# Altium schematic sheet NUMATO_HDR.SchDoc
size B
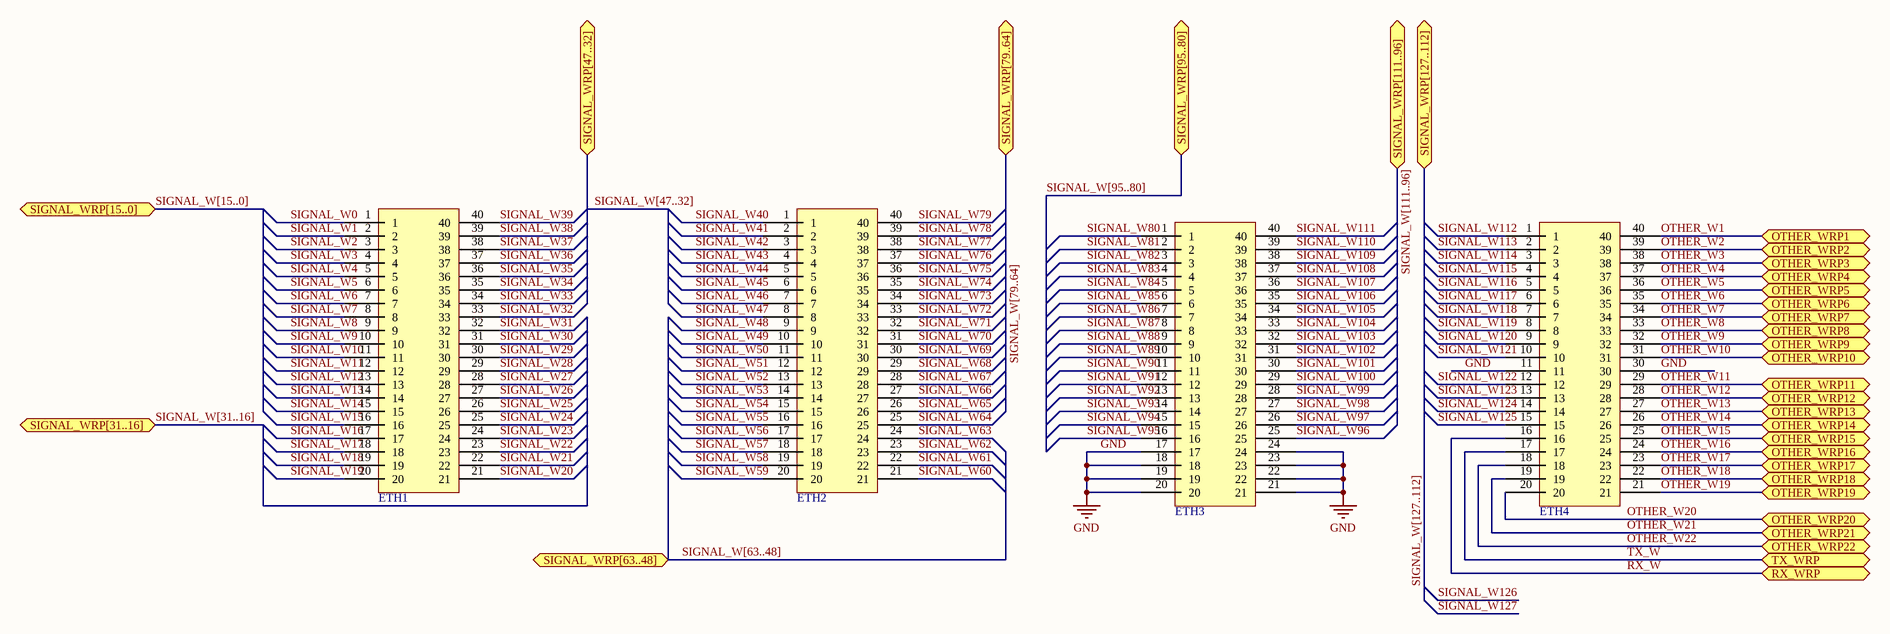
[diagram p0: NUMATO_HDR.SchDoc]

## Parts
ETH1  ADAFRUIT_HEADER  [FEMALE_HEADER_SMD]  (value not drawn)
ETH2  ADAFRUIT_HEADER  [FEMALE_HEADER_SMD]  (value not drawn)
ETH3  ADAFRUIT_HEADER  [FEMALE_HEADER_SMD]  (value not drawn)
ETH4  ADAFRUIT_HEADER  [FEMALE_HEADER_SMD]  (value not drawn)

## Ports
OTHER_WRP1, OTHER_WRP2, OTHER_WRP3, OTHER_WRP4, OTHER_WRP5, OTHER_WRP6, OTHER_WRP7, OTHER_WRP8, OTHER_WRP9, OTHER_WRP10, OTHER_WRP11, OTHER_WRP12, OTHER_WRP13, OTHER_WRP14, OTHER_WRP15, OTHER_WRP16, OTHER_WRP17, OTHER_WRP18, OTHER_WRP19, OTHER_WRP20, OTHER_WRP21, OTHER_WRP22, RX_WRP, SIGNAL_WRP[15..0], SIGNAL_WRP[31..16], SIGNAL_WRP[47..32], SIGNAL_WRP[63..48], SIGNAL_WRP[79..64], SIGNAL_WRP[95..80], SIGNAL_WRP[111..96], SIGNAL_WRP[127..112], TX_WRP

## Nets
GND: ETH3.17 ETH3.18 ETH3.19 ETH3.20 ETH3.21 ETH3.22 ETH3.23 ETH3.24 ETH4.11 ETH4.30
OTHER_W1: ETH4.40 ; port OTHER_WRP1
OTHER_W2: ETH4.39 ; port OTHER_WRP2
OTHER_W3: ETH4.38 ; port OTHER_WRP3
OTHER_W4: ETH4.37 ; port OTHER_WRP4
OTHER_W5: ETH4.36 ; port OTHER_WRP5
OTHER_W6: ETH4.35 ; port OTHER_WRP6
OTHER_W7: ETH4.34 ; port OTHER_WRP7
OTHER_W8: ETH4.33 ; port OTHER_WRP8
OTHER_W9: ETH4.32 ; port OTHER_WRP9
OTHER_W10: ETH4.31 ; port OTHER_WRP10
OTHER_W11: ETH4.29 ; port OTHER_WRP11
OTHER_W12: ETH4.28 ; port OTHER_WRP12
OTHER_W13: ETH4.27 ; port OTHER_WRP13
OTHER_W14: ETH4.26 ; port OTHER_WRP14
OTHER_W15: ETH4.25 ; port OTHER_WRP15
OTHER_W16: ETH4.24 ; port OTHER_WRP16
OTHER_W17: ETH4.23 ; port OTHER_WRP17
OTHER_W18: ETH4.22 ; port OTHER_WRP18
OTHER_W19: ETH4.21 ; port OTHER_WRP19
OTHER_W20: ETH4.20 ; port OTHER_WRP20
OTHER_W21: ETH4.19 ; port OTHER_WRP21
OTHER_W22: ETH4.18 ; port OTHER_WRP22
RX_W: ETH4.16 ; port RX_WRP
SIGNAL_W0: ETH1.1
SIGNAL_W1: ETH1.2
SIGNAL_W2: ETH1.3
SIGNAL_W3: ETH1.4
SIGNAL_W4: ETH1.5
SIGNAL_W5: ETH1.6
SIGNAL_W6: ETH1.7
SIGNAL_W7: ETH1.8
SIGNAL_W8: ETH1.9
SIGNAL_W9: ETH1.10
SIGNAL_W10: ETH1.11
SIGNAL_W11: ETH1.12
SIGNAL_W12: ETH1.13
SIGNAL_W13: ETH1.14
SIGNAL_W14: ETH1.15
SIGNAL_W15: ETH1.16
SIGNAL_W16: ETH1.17
SIGNAL_W17: ETH1.18
SIGNAL_W18: ETH1.19
SIGNAL_W19: ETH1.20
SIGNAL_W20: ETH1.21
SIGNAL_W21: ETH1.22
SIGNAL_W22: ETH1.23
SIGNAL_W23: ETH1.24
SIGNAL_W24: ETH1.25
SIGNAL_W25: ETH1.26
SIGNAL_W26: ETH1.27
SIGNAL_W27: ETH1.28
SIGNAL_W28: ETH1.29
SIGNAL_W29: ETH1.30
SIGNAL_W30: ETH1.31
SIGNAL_W31: ETH1.32
SIGNAL_W32: ETH1.33
SIGNAL_W33: ETH1.34
SIGNAL_W34: ETH1.35
SIGNAL_W35: ETH1.36
SIGNAL_W36: ETH1.37
SIGNAL_W37: ETH1.38
SIGNAL_W38: ETH1.39
SIGNAL_W39: ETH1.40
SIGNAL_W40: ETH2.1
SIGNAL_W41: ETH2.2
SIGNAL_W42: ETH2.3
SIGNAL_W43: ETH2.4
SIGNAL_W44: ETH2.5
SIGNAL_W45: ETH2.6
SIGNAL_W46: ETH2.7
SIGNAL_W47: ETH2.8
SIGNAL_W48: ETH2.9
SIGNAL_W49: ETH2.10
SIGNAL_W50: ETH2.11
SIGNAL_W51: ETH2.12
SIGNAL_W52: ETH2.13
SIGNAL_W53: ETH2.14
SIGNAL_W54: ETH2.15
SIGNAL_W55: ETH2.16
SIGNAL_W56: ETH2.17
SIGNAL_W57: ETH2.18
SIGNAL_W58: ETH2.19
SIGNAL_W59: ETH2.20
SIGNAL_W60: ETH2.21
SIGNAL_W61: ETH2.22
SIGNAL_W62: ETH2.23
SIGNAL_W63: ETH2.24
SIGNAL_W64: ETH2.25
SIGNAL_W65: ETH2.26
SIGNAL_W66: ETH2.27
SIGNAL_W67: ETH2.28
SIGNAL_W68: ETH2.29
SIGNAL_W69: ETH2.30
SIGNAL_W70: ETH2.31
SIGNAL_W71: ETH2.32
SIGNAL_W72: ETH2.33
SIGNAL_W73: ETH2.34
SIGNAL_W74: ETH2.35
SIGNAL_W75: ETH2.36
SIGNAL_W76: ETH2.37
SIGNAL_W77: ETH2.38
SIGNAL_W78: ETH2.39
SIGNAL_W79: ETH2.40
SIGNAL_W80: ETH3.1
SIGNAL_W81: ETH3.2
SIGNAL_W82: ETH3.3
SIGNAL_W83: ETH3.4
SIGNAL_W84: ETH3.5
SIGNAL_W85: ETH3.6
SIGNAL_W86: ETH3.7
SIGNAL_W87: ETH3.8
SIGNAL_W88: ETH3.9
SIGNAL_W89: ETH3.10
SIGNAL_W90: ETH3.11
SIGNAL_W91: ETH3.12
SIGNAL_W92: ETH3.13
SIGNAL_W93: ETH3.14
SIGNAL_W94: ETH3.15
SIGNAL_W95: ETH3.16
SIGNAL_W96: ETH3.25
SIGNAL_W97: ETH3.26
SIGNAL_W98: ETH3.27
SIGNAL_W99: ETH3.28
SIGNAL_W100: ETH3.29
SIGNAL_W101: ETH3.30
SIGNAL_W102: ETH3.31
SIGNAL_W103: ETH3.32
SIGNAL_W104: ETH3.33
SIGNAL_W105: ETH3.34
SIGNAL_W106: ETH3.35
SIGNAL_W107: ETH3.36
SIGNAL_W108: ETH3.37
SIGNAL_W109: ETH3.38
SIGNAL_W110: ETH3.39
SIGNAL_W111: ETH3.40
SIGNAL_W112: ETH4.1
SIGNAL_W113: ETH4.2
SIGNAL_W114: ETH4.3
SIGNAL_W115: ETH4.4
SIGNAL_W116: ETH4.5
SIGNAL_W117: ETH4.6
SIGNAL_W118: ETH4.7
SIGNAL_W119: ETH4.8
SIGNAL_W120: ETH4.9
SIGNAL_W121: ETH4.10
SIGNAL_W122: ETH4.12
SIGNAL_W123: ETH4.13
SIGNAL_W124: ETH4.14
SIGNAL_W125: ETH4.15
TX_W: ETH4.17 ; port TX_WRP

## Buses and harness runs
bus SIGNAL_W[15..0] = port SIGNAL_WRP[15..0]
bus SIGNAL_W[31..16] = port SIGNAL_WRP[31..16]
bus SIGNAL_W[47..32] = port SIGNAL_WRP[47..32]
bus SIGNAL_W[63..48] = port SIGNAL_WRP[63..48]
bus SIGNAL_W[79..64] = port SIGNAL_WRP[79..64]
bus SIGNAL_W[95..80] = port SIGNAL_WRP[95..80]
bus SIGNAL_W[111..96] = port SIGNAL_WRP[111..96]
bus SIGNAL_W[127..112] = port SIGNAL_WRP[127..112]

## Library data of the parts
ETH1-ETH4 = ADAFRUIT_HEADER: Extra tall female header (SMD)